# Altium schematic sheet IO.SchDoc
size A
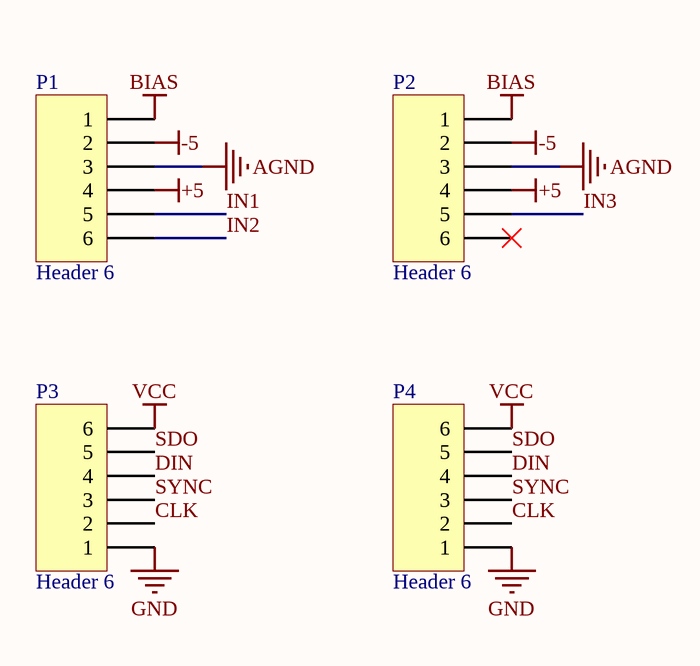
[diagram p0: IO.SchDoc]

## Parts
P1  Header 6  [HDR1X6]
P2  Header 6  [HDR1X6]
P3  Header 6  [HDR1X6]
P4  Header 6  [HDR1X6]

## Nets
+5: P1.4 P2.4
-5: P1.2 P2.2
AGND: P1.3 P2.3
BIAS: P1.1 P2.1
GND: P3.1 P4.1
VCC: P3.6 P4.6
CLK: P3.2 P4.2
DIN: P3.4 P4.4
IN1: P1.5
IN2: P1.6
IN3: P2.5
SDO: P3.5 P4.5
SYNC: P3.3 P4.3

Not connected (* = marked no-connect by the designer): P2 6*

## Library data of the parts
P1-P4 = Header 6: Header, 6-Pin; LatestRevisionDate: 17-Jul-2002; LatestRevisionNote: Re-released for DXP Platform.; Publisher: Altium Limited